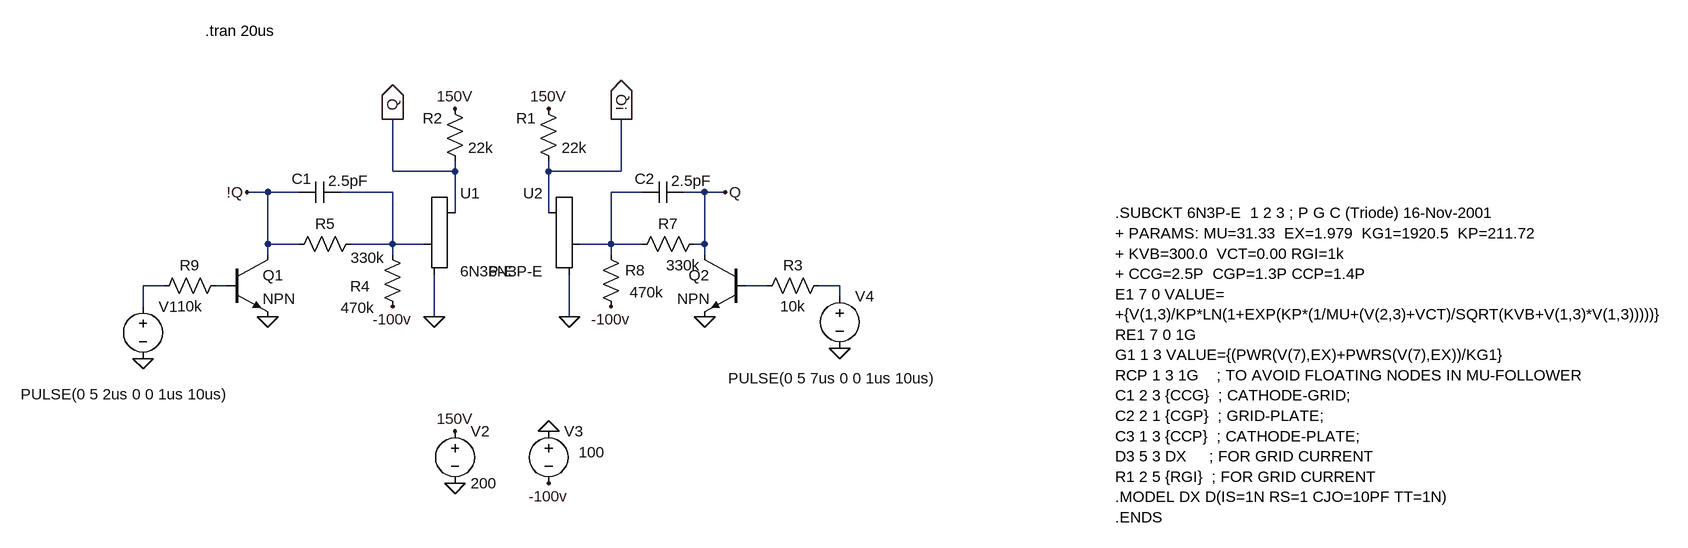
[diagram p0: schematic RS-trigger.asc]
RS-trigger.asc, the LTspice schematic file:
Version 4
SHEET 1 2516 760
WIRE 176 64 176 -16
WIRE 272 64 272 48
WIRE 272 64 176 64
WIRE 416 64 416 48
WIRE 528 64 528 -16
WIRE 528 64 416 64
WIRE -16 96 -48 96
WIRE 32 96 -16 96
WIRE 176 96 96 96
WIRE 560 96 512 96
WIRE 656 96 624 96
WIRE 688 96 656 96
WIRE 272 128 272 64
WIRE 416 128 416 64
WIRE -16 176 -16 96
WIRE 32 176 -16 176
WIRE 176 176 176 96
WIRE 176 176 112 176
WIRE 224 176 176 176
WIRE 512 176 512 96
WIRE 512 176 464 176
WIRE 560 176 512 176
WIRE 656 176 656 96
WIRE 656 176 640 176
WIRE -16 192 -16 176
WIRE 176 192 176 176
WIRE 512 192 512 176
WIRE 656 192 656 176
WIRE -176 240 -208 240
WIRE -80 240 -96 240
WIRE 752 240 720 240
WIRE 864 240 832 240
WIRE 864 256 864 240
WIRE -208 272 -208 240
WIRE 240 288 240 224
WIRE 448 288 448 224
FLAG 240 288 0
FLAG -208 352 0
FLAG 272 544 0
FLAG 416 464 0
FLAG 864 336 0
FLAG 416 544 -100v
FLAG 176 272 -100v
FLAG 512 272 -100v
FLAG 448 288 0
FLAG 272 -32 150V
FLAG 272 464 150V
FLAG 416 -32 150V
FLAG 176 -16 Q
IOPIN 176 -16 Out
FLAG 528 -16 !Q
IOPIN 528 -16 Out
FLAG -48 96 !Q
FLAG 688 96 Q
FLAG -16 288 0
FLAG 656 288 0
SYMBOL Misc\\triode 272 176 R0
SYMATTR InstName U1
SYMATTR Value 6N3P-E
SYMBOL voltage -208 256 R0
WINDOW 3 -188 151 Left 2
WINDOW 123 0 0 Left 0
WINDOW 39 -465 170 Left 2
SYMATTR Value PULSE(0 5 2us 0 0 1us 10us)
SYMATTR InstName V1
SYMBOL voltage 272 448 R0
WINDOW 123 0 0 Left 0
WINDOW 39 0 0 Left 0
SYMATTR InstName V2
SYMATTR Value 200
SYMBOL res 256 -48 R0
WINDOW 0 -34 30 Left 2
SYMATTR InstName R2
SYMATTR Value 22k
SYMBOL res 160 176 R0
WINDOW 0 -49 65 Left 2
WINDOW 3 -64 98 Left 2
SYMATTR InstName R4
SYMATTR Value 470k
SYMBOL voltage 416 448 R0
WINDOW 3 46 48 Left 2
WINDOW 123 0 0 Left 0
WINDOW 39 0 0 Left 0
SYMATTR Value 100
SYMATTR InstName V3
SYMBOL res 128 160 R90
WINDOW 0 0 56 VBottom 2
WINDOW 3 21 -10 VTop 2
SYMATTR InstName R5
SYMATTR Value 330k
SYMBOL cap 96 80 R90
WINDOW 0 11 60 VBottom 2
WINDOW 3 -17 -12 VTop 2
SYMATTR InstName C1
SYMATTR Value 2.5pF
SYMBOL Misc\\triode 416 176 M0
SYMATTR InstName U2
SYMATTR Value 6N3P-E
SYMBOL voltage 864 240 R0
WINDOW 3 -172 142 Left 2
WINDOW 123 0 0 Left 0
WINDOW 39 -465 170 Left 2
SYMATTR Value PULSE(0 5 7us 0 0 1us 10us)
SYMATTR InstName V4
SYMBOL res 656 160 R90
WINDOW 0 0 56 VBottom 2
WINDOW 3 33 33 VTop 2
SYMATTR InstName R7
SYMATTR Value 330k
SYMBOL cap 624 80 R90
WINDOW 0 11 60 VBottom 2
WINDOW 3 -17 -12 VTop 2
SYMATTR InstName C2
SYMATTR Value 2.5pF
SYMBOL res 528 288 R180
WINDOW 0 -37 72 Left 2
WINDOW 3 -65 38 Left 2
SYMATTR InstName R8
SYMATTR Value 470k
SYMBOL res 400 -48 R0
WINDOW 0 -34 30 Left 2
SYMATTR InstName R1
SYMATTR Value 22k
SYMBOL res -80 224 R90
WINDOW 0 0 56 VBottom 2
WINDOW 3 32 56 VTop 2
SYMATTR InstName R9
SYMATTR Value 10k
SYMBOL npn -80 192 R0
SYMATTR InstName Q1
SYMBOL npn 720 192 M0
SYMATTR InstName Q2
SYMBOL res 848 224 R90
WINDOW 0 0 56 VBottom 2
WINDOW 3 32 56 VTop 2
SYMATTR InstName R3
SYMATTR Value 10k
TEXT 1288 128 Left 2 !.SUBCKT 6N3P-E  1 2 3 ; P G C (Triode) 16-Nov-2001\n+ PARAMS: MU=31.33  EX=1.979  KG1=1920.5  KP=211.72 \n+ KVB=300.0  VCT=0.00 RGI=1k\n+ CCG=2.5P  CGP=1.3P CCP=1.4P\nE1 7 0 VALUE=\n+{V(1,3)/KP*LN(1+EXP(KP*(1/MU+(V(2,3)+VCT)/SQRT(KVB+V(1,3)*V(1,3)))))}\nRE1 7 0 1G\nG1 1 3 VALUE={(PWR(V(7),EX)+PWRS(V(7),EX))/KG1}\nRCP 1 3 1G    ; TO AVOID FLOATING NODES IN MU-FOLLOWER\nC1 2 3 {CCG}  ; CATHODE-GRID; \nC2 2 1 {CGP}  ; GRID-PLATE; \nC3 1 3 {CCP}  ; CATHODE-PLATE; \nD3 5 3 DX     ; FOR GRID CURRENT\nR1 2 5 {RGI}  ; FOR GRID CURRENT\n.MODEL DX D(IS=1N RS=1 CJO=10PF TT=1N)\n.ENDS
TEXT -112 -152 Left 2 !.tran 20us

The netlist it stands for:
* RS-trigger.asc
XU1 Q N001 0 6N3P-E
V1 N003 0 PULSE(0 5 2us 0 0 1us 10us)
V2 150V 0 200
R2 150V Q 22k
R4 N001 -100v 470k
V3 0 -100v 100
R5 N001 !Q 330k
C1 N001 !Q 2.5pF
XU2 !Q N002 0 6N3P-E
V4 N006 0 PULSE(0 5 7us 0 0 1us 10us)
R7 Q N002 330k
C2 Q N002 2.5pF
R8 -100v N002 470k
R1 150V !Q 22k
R9 N004 N003 10k
Q1 !Q N004 0 0 NPN
Q2 Q N005 0 0 NPN
R3 N006 N005 10k
.model NPN NPN
.model PNP PNP
.lib standard.bjt
.SUBCKT 6N3P-E  1 2 3 ; P G C (Triode) 16-Nov-2001
+ PARAMS: MU=31.33  EX=1.979  KG1=1920.5  KP=211.72
+ KVB=300.0  VCT=0.00 RGI=1k
+ CCG=2.5P  CGP=1.3P CCP=1.4P
E1 7 0 VALUE=
+{V(1,3)/KP*LN(1+EXP(KP*(1/MU+(V(2,3)+VCT)/SQRT(KVB+V(1,3)*V(1,3)))))}
RE1 7 0 1G
G1 1 3 VALUE={(PWR(V(7),EX)+PWRS(V(7),EX))/KG1}
RCP 1 3 1G    ; TO AVOID FLOATING NODES IN MU-FOLLOWER
C1 2 3 {CCG}  ; CATHODE-GRID;
C2 2 1 {CGP}  ; GRID-PLATE;
C3 1 3 {CCP}  ; CATHODE-PLATE;
D3 5 3 DX     ; FOR GRID CURRENT
R1 2 5 {RGI}  ; FOR GRID CURRENT
.MODEL DX D(IS=1N RS=1 CJO=10PF TT=1N)
.ENDS
.tran 20us
.backanno
.end